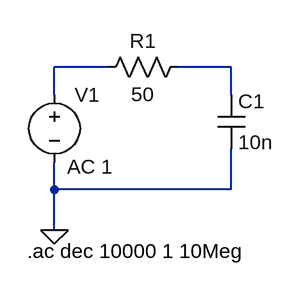
[diagram p0: schematic Circuito2.asc]
Circuito2.asc, the LTspice schematic file:
Version 4
SHEET 1 880 680
WIRE 80 80 16 80
WIRE 224 80 160 80
WIRE 16 112 16 80
WIRE 224 112 224 80
WIRE 16 224 16 192
WIRE 224 224 224 176
WIRE 224 224 16 224
WIRE 16 272 16 224
FLAG 16 272 0
SYMBOL res 176 64 R90
WINDOW 0 0 56 VBottom 2
WINDOW 3 32 56 VTop 2
SYMATTR InstName R1
SYMATTR Value 50
SYMBOL cap 208 112 R0
SYMATTR InstName C1
SYMATTR Value 10n
SYMBOL voltage 16 96 R0
WINDOW 123 15 101 Left 2
WINDOW 39 0 0 Left 0
SYMATTR Value2 AC 1
SYMATTR InstName V1
SYMATTR Value ""
TEXT -16 296 Left 2 !.ac dec 10000 1 10Meg

The netlist it stands for:
* Circuito2.asc
R1 N002 N001 50
C1 N002 0 10n
V1 N001 0 AC 1
.ac dec 10000 1 10Meg
.backanno
.end